# Altium schematic sheet HVP_DiffAmplifier_v1.0.SchDoc
size A3; Organization: SEW EURODRIVE; Address1: Jose Rubim Rd.; Address2: Santos Dumont Rd.; Address3: 205; Address4: Indaiatuba/SP; Address5: Brazil
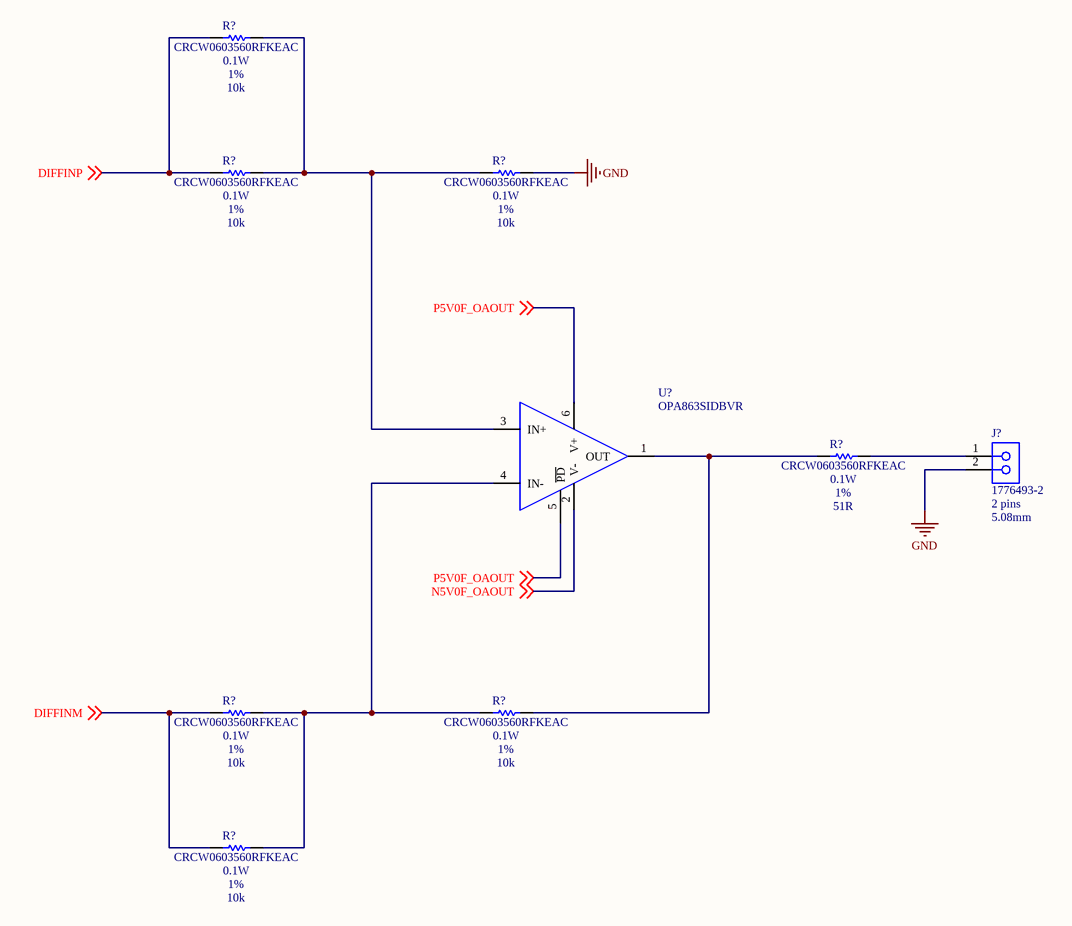
[diagram p0: HVP_DiffAmplifier_v1.0.SchDoc]

## Parts
(Parts that share a designator on the sheet are numbered #1, #2 ... from top to bottom, then left to right.)
J?  1776493-2  Pins: 2 pins  Pitch: 5.08mm  [PT 1,5/ 2-5,0-H]
R?#1  value 10k  PartNumber1: CRCW0603560RFKEAC  Power: 0.1W  Tolerance: 1%  [RES0603]  (hidden comment: Chip Resistor)
R?#2  value 10k  PartNumber1: CRCW0603560RFKEAC  Power: 0.1W  Tolerance: 1%  [RES0603]  (hidden comment: Chip Resistor)
R?#3  value 10k  PartNumber1: CRCW0603560RFKEAC  Power: 0.1W  Tolerance: 1%  [RES0603]  (hidden comment: Chip Resistor)
R?#4  value 51R  PartNumber1: CRCW0603560RFKEAC  Power: 0.1W  Tolerance: 1%  [RES0603]  (hidden comment: Chip Resistor)
R?#5  value 10k  PartNumber1: CRCW0603560RFKEAC  Power: 0.1W  Tolerance: 1%  [RES0603]  (hidden comment: Chip Resistor)
R?#6  value 10k  PartNumber1: CRCW0603560RFKEAC  Power: 0.1W  Tolerance: 1%  [RES0603]  (hidden comment: Chip Resistor)
R?#7  value 10k  PartNumber1: CRCW0603560RFKEAC  Power: 0.1W  Tolerance: 1%  [RES0603]  (hidden comment: Chip Resistor)
U?  OPA863SIDBVR  [SOT23-6]

## Nets
GND: J?.2 R?#3.1
DIFFINM: R?#5.2 R?#7.2 ; off-sheet DIFFINM
DIFFINP: R?#1.2 R?#2.2 ; off-sheet DIFFINP
N5V0F_OAOUT: U?.2(V-) ; off-sheet N5V0F_OAOUT
P5V0F_OAOUT: U?.5(~{PD}) U?.6(V+) ; off-sheet P5V0F_OAOUT
NetJ?_1: J?.1 R?#4.1
NetR?#1_1: R?#1.1 R?#2.1 R?#3.2 U?.3(IN+)
NetR?#4_2: R?#4.2 R?#6.1 U?.1(OUT)
NetR?#5_1: R?#5.1 R?#6.2 R?#7.1 U?.4(IN-)

## Notes on the sheet
- Title
- Author
- Checked By
- Size:
- Revision:
- A3
- Date:
- Project
- Time:
- Sheet
- of
- File:

## Library data of the parts
J? = 1776493-2: Fixed Terminal Blocks SIDE WIRE ENTRY TB 5.08MM BL; Manufacter1: TE Connectivity; Published: 31-Jul-2017; LatestRevisionDate: 31-Jul-2017; PackageReference: 1776493-2; Publisher: Lucas Moraes; PackageDescription: 1776493-2; 2 Leads; Type: Fixed Terminal Blocks; PartNumber1: 1776493-2; Color: Blue
R?#1-R?#7 = CRCW0603: Thick Film Chip Resistors with CECC Approval,  available with Established Reliability; Manufacter1: Vishay; LatestRevisionDate: 06-May-2016; PackageReference: 0603; Publisher: Lucas Moraes; PackageDescription: SMD 0603; 2 Leads; Published: 06-May-2016
U? = OPA863SIDBVR: High Speed Operational Amplifiers Dual, low-power, 110-MHz, 12-V, rail-to-rail input and output (RRIO) voltage-feedback amplifier; Manufacter1: Texas Instruments; Power: 200mW; Published: 18-Apr-2023; LatestRevisionDate: 18-Apr-2023; LatestRevisionNote: Created; PackageReference: SOIC8; Publisher: Lucas Moraes; PackageDescription: SOIC8; 8 Leads; Datasheet: https://www.ti.com/lit/ds/symlink/opa863.pdf; PartNumber1: OPA863SIDBVR